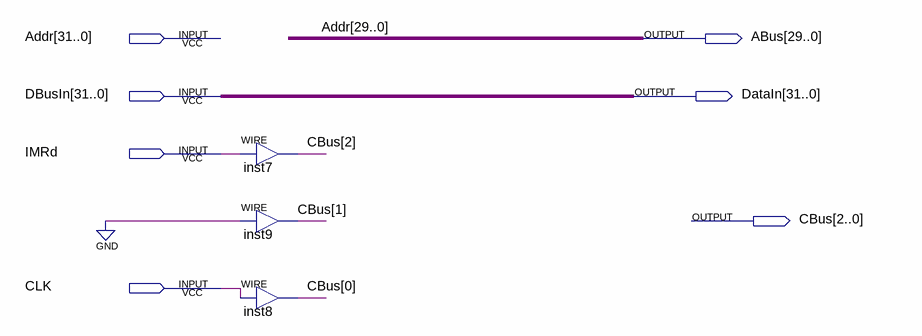
[diagram p0: schematic sheet]
// Quartus schematic IBIU.bdf as structural Verilog: 3 symbols, 7 pins
module IBIU (
  input  [31:0] Addr,
  input  [31:0] DBusIn,
  input  IMRd,
  input  CLK,
  output [29:0] ABus,
  output [31:0] DataIn,
  output [2:0] CBus
);

  assign CBus[2] = IMRd;  // WIRE inst7
  assign CBus[1] = 1'b0;  // WIRE inst9
  assign CBus[0] = CLK;  // WIRE inst8

  assign ABus = Addr[29:0];
  assign DataIn = DBusIn;
endmodule
